# EAGLE design ArduitsyR2 (EAGLE 8.0.0)
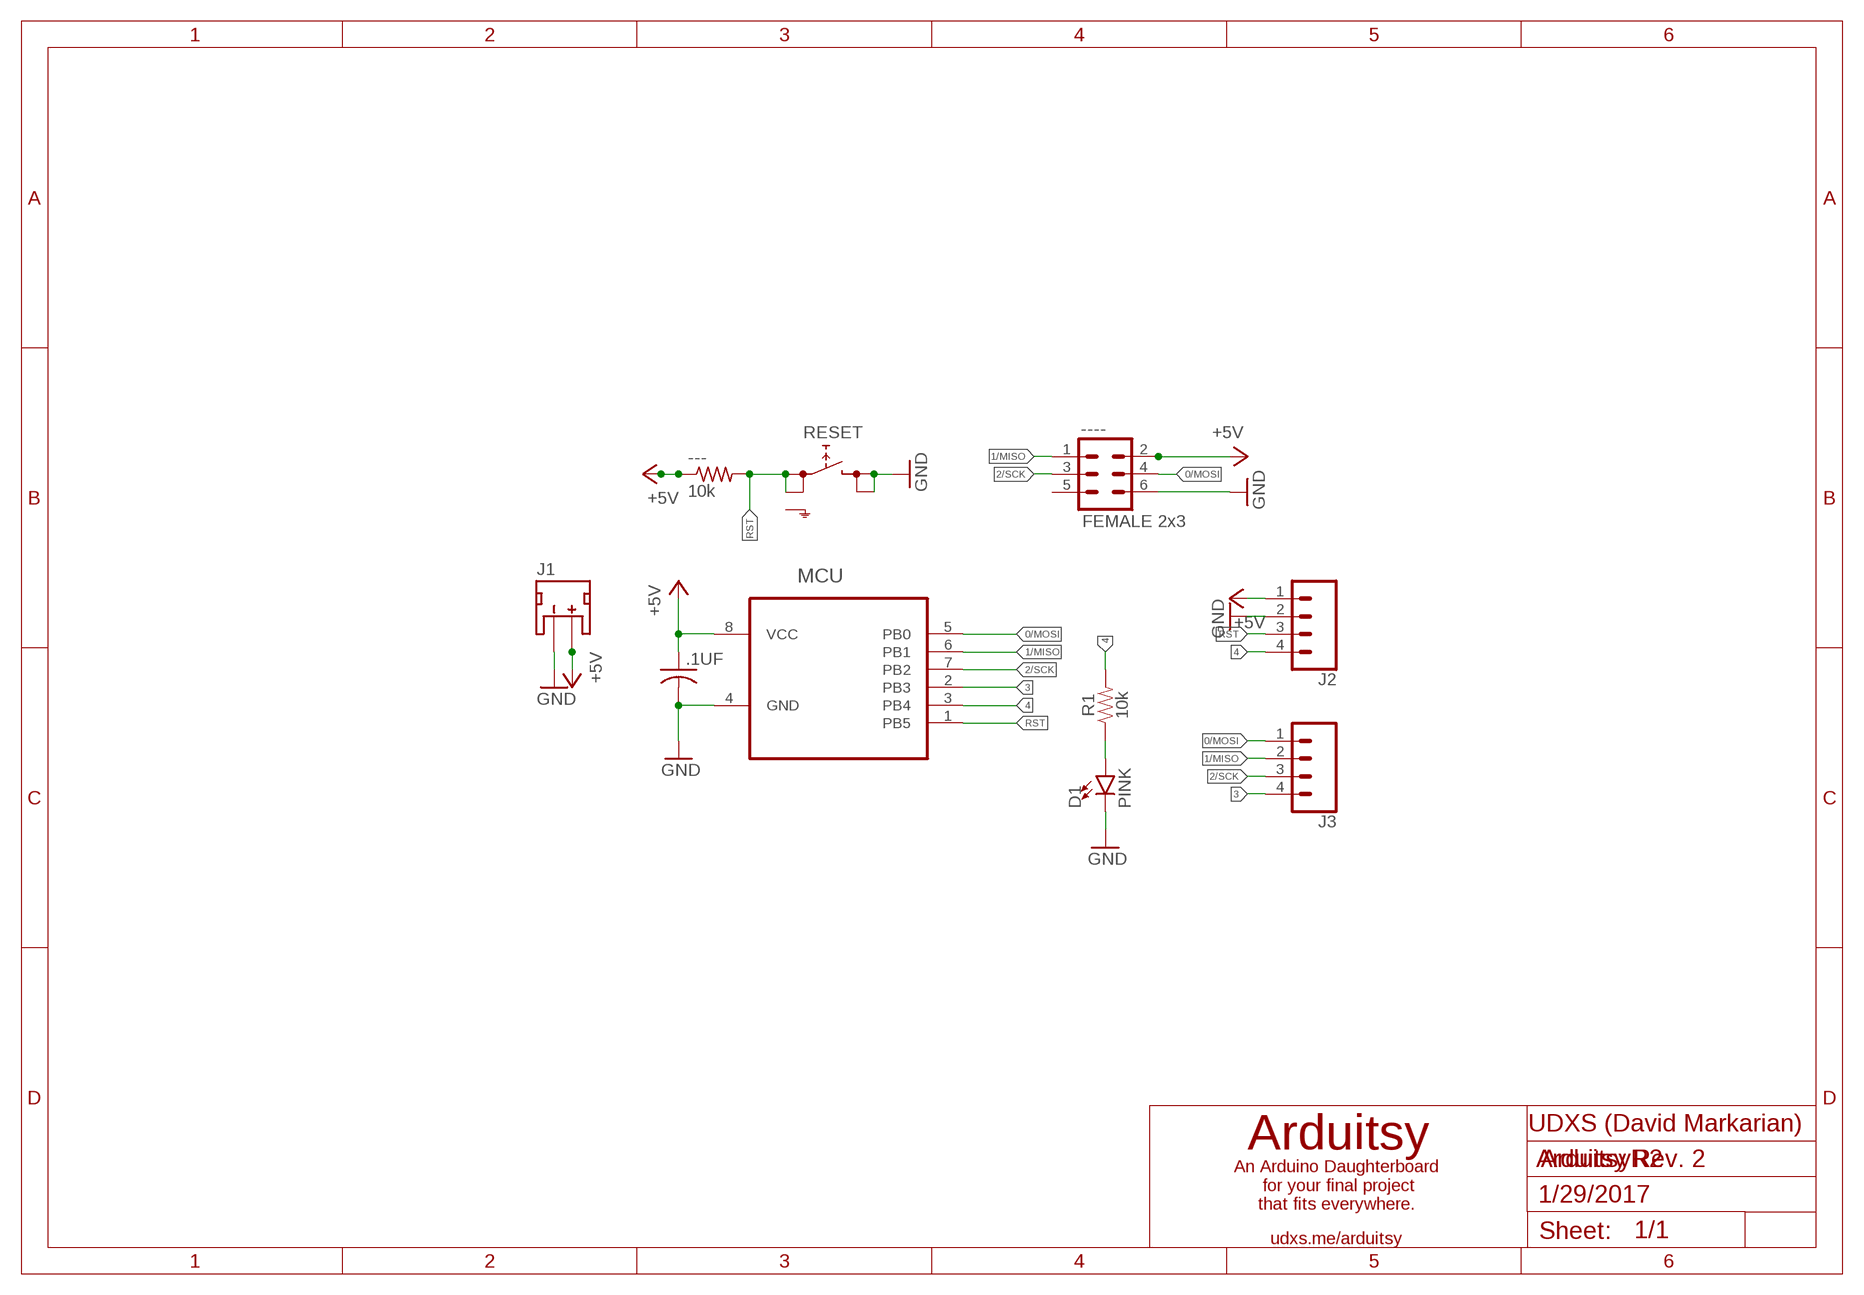
[diagram p0: schematic, sheet 1]

## Parts
---  10k  R-US_M0805  [M0805]
----  FEMALE 2x3  CONN_03X2FEMALE  [2X3]
.1UF  C-USC0805  [C0805]
D1  PINK  LED-PINK1206  [LED-1206]
J1  +5V  JST_2MM_MALE  [JST-2-SMD]
J2  CONN_04  [1X04]
J3  CONN_04  [1X04]
MCU  ATTINY85-20SU  [SOIC127P798X216-8N]
R1  10k  10KOHM-0603-1/10W-1%  [0603]
RESET  SKHMPSE010  [SKHMPXE010]

## Nets
0/MOSI: ----.4 J3.1 MCU.5(PB0)
1/MISO: ----.1 J3.2 MCU.6(PB1)
2/SCK: ----.3 J3.3 MCU.7(PB2)
3: J3.4 MCU.2(PB3)
4: J2.4 MCU.3(PB4) R1.2
+5V: ----.2 ---.1 .1UF.1 J1.2(+) J2.1 MCU.8(VCC)
GND: ----.6 .1UF.2 D1.C J1.1(-) J2.2 MCU.4(GND) RESET.3(2.1) RESET.4(2.2)
N$1: D1.A R1.1
RST: ---.2 J2.3 MCU.1(PB5) RESET.1(1.1) RESET.2(1.2)
Unconnected: ----.5 J1.NC1(PAD1) J1.NC2(PAD2) RESET.5(SH)

## Notes on the sheet
- UDXS (David Markarian)
- Arduitsy
- Arduitsy Rev. 2
- An Arduino Daughterboard
   for your final project
  that fits everywhere.
- 1/29/2017
- udxs.me/arduitsy

## Library data of the parts
--- = rcl:R-US_: RESISTOR, American symbol
---- = SparkFun-Connectors:CONN_03X2: Multi connection point. Often used as Generic Header-pin footprint for 0.1 inch spaced/style header connections You can populate with any combo of single row headers, but if you'd like an exact match, check these: Header - 2x3 (Male, 0.1") <https://www.sparkfun.com/products/12807> (PRT-12807) Header - 2x3 (Female, 0.1") <https://www.sparkfun.com/products/13010> (PRT-13010) 2x3 Pin Shrouded Header <https://www.sparkfun.com/products/10877> (PRT-10877) On any of the 0.1 inch spaced packages, you can populate with these: Break Away Headers - Straight <https://www.sparkfun.com/products/116> (PRT-00116) Break Away Male Headers - Right Angle <https://www.sparkfun.com/products/553> (PRT-00553) Female Headers <https://www.sparkfun.com/products/115> (PRT-00115) Break Away Headers - Machine Pin <https://www.sparkfun.com/products/117> (PRT-00117) Break Away Female Headers - Swiss Machine Pin <https://www.sparkfun.com/products/743> (PRT-00743) Special note: the shrouded connector mates well with our 3x2 ribbon cables: Ribbon Crimp Connector - 6-pin (2x3, Female) <https://www.sparkfun.com/products/10651> (PRT-10651) Ribbon Cable - 6 wire (15ft) <https://www.sparkfun.com/products/10646> (PRT-10646); PROD_ID: CONN-11566
.1UF = rcl:C-US: CAPACITOR, American symbol
D1 = SparkFun-LED:LED-PINK: Pink SMD LED Used in manufacturing of various products at SparkFun Packages: 0603 - SMD 0603 package [Product Link] <http://cdn.sparkfun.com/datasheets/Components/General/S1206PKSBJC.pdf> SparkFun Products: LilyPad LED Pink <https://www.sparkfun.com/products/10962>; PROD_ID: DIO-10415
J1 = SparkFun-Connectors:JST_2MM_MALE: JST 2MM MALE RA CONNECTOR Two pin, compact surface mount connector. Commonly used as a battery input connection point. We really like the solid locking feeling and high current rating on these small connectors. We use these all the time as battery connectors. Mates to single-cell LiPo batteries. Here is the connector we sell at SparkFun: JST Right Angle Connector - White <https://www.sparkfun.com/products/8612> (PRT-08612) Datasheet <http://www.sparkfun.com/datasheets/Prototyping/Connectors/JST-Horizontal.pdf> It was used on these SparkFun products: SparkFun MOSFET Power Controller <https://www.sparkfun.com/products/11214> (PRT-11214) SparkFun Battery Babysitter - LiPo Battery Manager <https://www.sparkfun.com/products/13777> (PRT-13777) And many, many others that required a lipo battery connection.; PROD_ID: CONN-11443; SF_ID: PRT-08612
J2 J3 = SparkFun-Connectors:CONN_04: Multi connection point. Often used as Generic Header-pin footprint for 0.1 inch spaced/style header connections On any of the 0.1 inch spaced packages, you can populate with these: Break Away Headers - Straight <https://www.sparkfun.com/products/116> (PRT-00116) Break Away Male Headers - Right Angle <https://www.sparkfun.com/products/553> (PRT-00553) Female Headers <https://www.sparkfun.com/products/115> (PRT-00115) Break Away Headers - Machine Pin <https://www.sparkfun.com/products/117> (PRT-00117) Break Away Female Headers - Swiss Machine Pin <https://www.sparkfun.com/products/743> (PRT-00743) For SCREWTERMINALS and SPRING TERMINALS visit here: Screw Terimnals on SparkFun.com <https://www.sparkfun.com/search/results?term=Screw+Terminals> (5mm/3.5mm/2.54mm spacing) This device is also useful as a general connection point to wire up your design to another part of your project. Our various solder wires solder well into these plated through hole pads. Hook-Up Wire - Assortment (Stranded, 22 AWG) <https://www.sparkfun.com/products/11375> (PRT-11375) Hook-Up Wire - Assortment (Solid Core, 22 AWG) <https://www.sparkfun.com/products/11367> (PRT-11367) View the entire wire category on our website here <https://www.sparkfun.com/categories/141> Special notes: Molex polarized connector foot print use with SKU : PRT-08231 with associated crimp pins and housings. 1MM SMD Version SKU: PRT-10208; PROD_ID: CONN-09696
MCU = Atmel_By_element14_Batch_1-00:ATTINY85-20SU: 8-bit Microcontroller with In-System Programmable Flash; MPN: ATTINY85-20SU; OC_FARNELL: 1455164; OC_NEWARK: 58M3797; PACKAGE: SOIC-8; SUPPLIER: Atmel
R1 = SparkFun-Resistors:10KOHM: 10kΩ resistor A resistor is a passive two-terminal electrical component that implements electrical resistance as a circuit element. Resistors act to reduce current flow, and, at the same time, act to lower voltage levels within circuits. - Wikipedia; PROD_ID: RES-00824
RESET = switch:SKHMP*E010: 6.2 X 6.5mm TACT Switch (SMD) Source: http://www3.alps.co.jp/WebObjects/catalog.woa/PDF/E/Switch/Tact/SKHM/SKHM.PDF

## Board
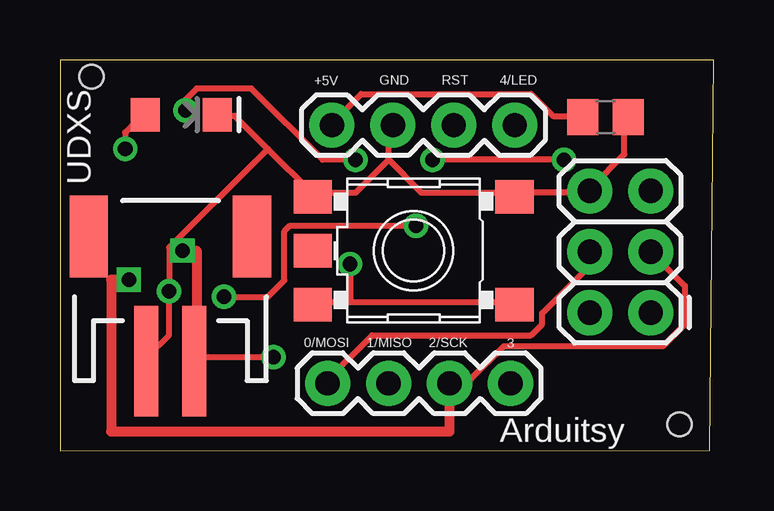
[diagram p1: board, top side]
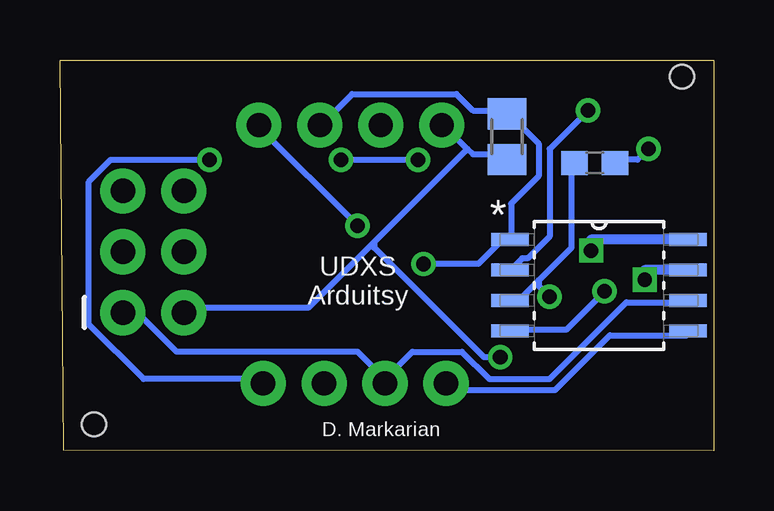
[diagram p2: board, bottom side, seen from below]

Size 27.23 x 16.31 mm. Coordinates in mm from the lower left corner, seen from the top.
Outline: 0,0 27.08,0.03 27.23,16.31 0,16.31 0,0
Copper layers (1*16): Top 0.035mm / dielectric 1.5mm / Bottom 0.035mm
Design rules "default": minimum track width 10mil, minimum drill 24mil, track to track 8mil, track to pad 8mil, pad to pad 8mil, via to via 8mil, smd to smd 8mil, copper to edge 40mil, drill to drill 8mil, minimum pad ring 10mil, minimum via ring 8mil, stop-mask expansion 4mil, vias tented up to drill 0mil, thermal gap 10mil
Holes 1 mm at 25.82,1.11 1.32,15.61

### Footprints (pad centres in the part's own frame; a part is rotated, then mirrored left to right if it is on the bottom)
M0805 = smd 1.3 x 1.6: 1 -0.95,0; 2 0.95,0
2X3 = drill 1.016 pad 1.88: 1 0,0; 2 0,2.54; 3 2.54,0; 4 2.54,2.54; 5 5.08,0; 6 5.08,2.54
C0805 = smd 1.3 x 1.5: 1 -0.95,0; 2 0.95,0
LED-1206 = smd 1.2 x 1.4: A -1.5,0; C 1.5,0
JST-2-SMD = smd 1 x 4.6: 1 -1,-3.7; 2 1,-3.7 | smd 1.6 x 3.4: NC1 -3.4,1.5; NC2 3.4,1.5
1X04 = drill 1.016 pad 1.88: 1 0,0; 2 2.54,0; 3 5.08,0; 4 7.62,0
SOIC127P798X216-8N = smd 1.549 x 0.533: 1 -3.708,1.905; 2 -3.708,0.635; 3 -3.708,-0.635; 4 -3.708,-1.905; 5 3.708,-1.905; 6 3.708,-0.635; 7 3.708,0.635; 8 3.708,1.905
0603 = smd 1.1 x 1: 1 -0.85,0; 2 0.85,0
SKHMPXE010 = smd 1.6 x 1.4: 1 -4.2,2.25; 2 4.2,2.25; 3 -4.2,-2.25; 4 4.2,-2.25; 5 4.2,0

### Placement (x,y rotation side)
---  8.61,13.11 90 bottom
----  24.61,5.77 90 top
.1UF  22.73,13.92 0 top
D1  5.05,14.02 0 top
J1  4.6,7.44 0 top
J2  11.33,13.59 0 top
J3  11.15,2.82 0 top
MCU  4.78,6.91 0 bottom
R1  4.95,12.01 180 bottom
RESET  14.73,8.36 180 top

### Tracks (layer width: path | path; a pad name or v marks a point on that pad's centre or on a via)
0/MOSI
  Top 0.254: ----.4 21.92,8.26 21.92,7.57 20.09,5.74 20.09,5.28 19.63,4.83 13,4.83 11.18,3 J3.1
  Bottom 0.254: MCU.5 1.12,4.83 4.32,4.83 6.6,2.54 10.72,2.54 10.95,2.77 J3.1
1/MISO
  Bottom 0.254: 13.69,3 12.55,4.14 10.49,4.14 9.35,3 6.83,3 3.63,6.2 1.12,6.2 MCU.6 | 13.69,3 14.83,4.14 22.38,4.14 23.98,5.74 24.43,5.74 ----.1 | 13.69,3 J3.2
2/SCK  (via drill 0.6)
  Top 0.254: ----.3 26.04,6.88 26.04,5.28 25.12,4.37 18.49,4.37 17.12,3 16.43,3 J3.3
  Top 0.406: v2.87,7.14 2.13,7.14 2.13,0.81 16.23,0.81 J3.3
  Bottom 0.406: MCU.7 2.87,7.54 v2.87,7.14
3  (via drill 0.61)
  Top 0.254: v5.23,14.2 5.23,14.66 5.69,15.11 7.98,15.11 10.95,12.14 v12.32,12.14 | v21.01,12.14 v15.52,12.14
  Bottom 0.254: v5.23,14.2 6.83,12.6 6.83,8.94 7.75,8.03 7.98,8.03 8.43,7.57 MCU.2 | v15.52,12.14 v12.32,12.14 | v21.01,12.14 25.12,12.14 26.04,11.23 26.04,5.28 23.75,3 18.95,3 J3.4
4  (via drill 0.61)
  Top 0.254: v14.83,9.4 9.58,9.4 9.35,9.17 9.35,7.11 8.66,6.43 v6.83,6.43
  Bottom 0.254: 7.29,7.11 7.98,6.43 8.43,6.43 MCU.3 | 7.29,7.11 5.92,8.48 5.92,11.91 R1.2 | v14.83,9.4 18.95,13.51 J2.4 | v6.83,6.43 7.29,6.88 7.29,7.11
+5V  (via drill 0.6, 0.61)
  Top 0.254: .1UF.1 21.69,13.97 20.55,13.97 19.63,14.88 12.55,14.88 11.4,13.74 J2.1 | v8.89,3.91 5.69,3.91 J1.2
  Top 0.406: v5.11,8.36 5.69,8.36 5.69,3.91
  Bottom 0.254: 10.26,12.6 11.18,13.51 J2.1 | 10.26,12.6 10.03,12.37 8.66,12.37 ---.1 | 10.26,12.6 14.15,8.71 | 14.15,8.71 16.89,5.97 21.92,5.97 ----.2 | v8.89,3.91 9.58,3.91 14.15,8.48 14.15,8.71
  Bottom 0.406: MCU.8 5.11,8.81 v5.11,8.36
GND  (via drill 0.61)
  Top 0.254: J1.1 3.63,3.91 4.55,4.83 v4.55,6.65 4.55,8.48 8.66,12.6 | .1UF.2 23.52,13.74 23.52,12.37 22.15,11 ----.6 21.92,10.77 18.95,10.77 RESET.3 18.72,10.77 15.06,10.77 13.69,12.14 | 8.66,12.6 10.49,10.77 RESET.4 10.72,10.77 12.32,10.77 13.69,12.14 | 8.66,12.6 7.29,13.97 6.6,13.97 D1.C | 13.69,12.14 13.69,13.51 J2.2
  Bottom 0.254: v4.55,6.65 6.15,5.05 8.43,5.05 MCU.4
N$1  (via drill 0.61)
  Top 0.254: v2.72,12.6 2.72,13.28 3.4,13.97 D1.A
  Bottom 0.254: v2.72,12.6 3.17,12.14 4.09,12.14 R1.1
RST  (via drill 0.61)
  Top 0.254: 12.09,6.2 18.72,6.2 RESET.1 | 12.09,6.2 10.72,6.2 RESET.2 | v12.09,7.8 12.09,6.2
  Bottom 0.254: J2.3 16.21,13.74 15.06,14.88 10.72,14.88 10.03,14.2 8.66,14.2 ---.2 8.43,13.97 7.29,12.83 7.29,11.46 8.43,10.31 8.43,8.94 MCU.1 8.66,8.94 9.8,7.8 v12.09,7.8

### Text on the board
tPlace: +5V | GND | RST | 4/LED | UDXS | 0/MOSI | 1/MISO | 2/SCK | 3 | Arduitsy
bPlace: UDXS / Arduitsy | D. Markarian